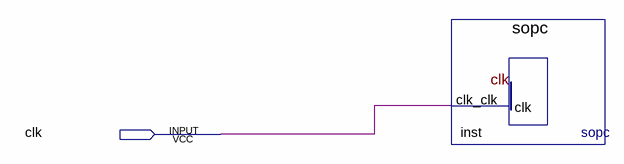
[diagram p0: schematic sheet]
// Quartus schematic nios_fast.bdf as structural Verilog: 1 symbols, 1 pins
module nios_fast (
  input  clk
);

  sopc inst (.clk_clk(clk));
endmodule
